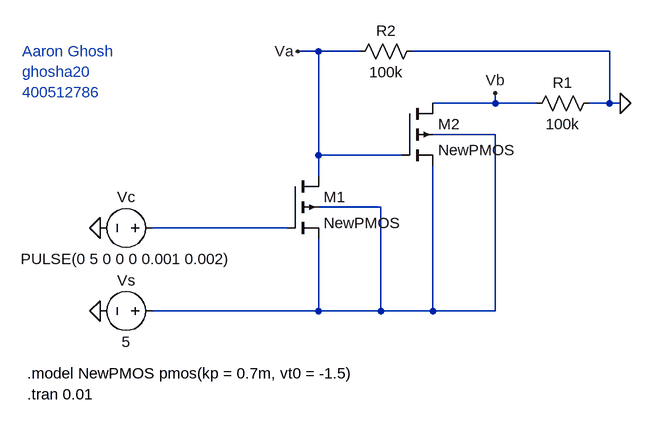
[diagram p0: schematic Project 2 Switch 2.asc]
Project 2 Switch 2.asc, the LTspice schematic file:
Version 4.1
SHEET 1 880 680
WIRE 240 64 208 64
WIRE 304 64 240 64
WIRE 688 64 384 64
WIRE 512 144 512 128
WIRE 512 144 416 144
WIRE 576 144 512 144
WIRE 688 144 688 64
WIRE 688 144 656 144
WIRE 704 144 688 144
WIRE 512 192 416 192
WIRE 240 224 240 64
WIRE 368 224 240 224
WIRE 240 256 240 224
WIRE 336 304 240 304
WIRE 192 336 -16 336
WIRE 240 464 240 352
WIRE 240 464 -16 464
WIRE 336 464 336 304
WIRE 336 464 240 464
WIRE 416 464 416 240
WIRE 416 464 336 464
WIRE 512 464 512 192
WIRE 512 464 416 464
FLAG -96 336 0
FLAG -96 464 0
FLAG 704 144 0
FLAG 208 64 Va
FLAG 512 128 Vb
SYMBOL voltage 0 336 R90
WINDOW 0 -32 56 VBottom 2
WINDOW 3 32 56 VTop 2
WINDOW 123 0 0 Left 0
WINDOW 39 0 0 Left 0
SYMATTR InstName Vc
SYMATTR Value PULSE(0 5 0 0 0 0.001 0.002)
SYMBOL voltage 0 464 R90
WINDOW 0 -32 56 VBottom 2
WINDOW 3 32 56 VTop 2
SYMATTR InstName Vs
SYMATTR Value 5
SYMBOL pmos4 192 256 R0
SYMATTR InstName M1
SYMATTR Value NewPMOS
SYMBOL pmos4 368 144 R0
SYMATTR InstName M2
SYMATTR Value NewPMOS
SYMBOL res 672 128 R90
WINDOW 0 0 56 VBottom 2
WINDOW 3 32 56 VTop 2
SYMATTR InstName R1
SYMATTR Value 100k
SYMBOL res 400 48 R90
WINDOW 0 0 56 VBottom 2
WINDOW 3 32 56 VTop 2
SYMATTR InstName R2
SYMATTR Value 100k
TEXT -216 64 Left 2 ;Aaron Ghosh\nghosha20\n400512786
TEXT -208 560 Left 2 !.model NewPMOS pmos(kp = 0.7m, vt0 = -1.5)
TEXT -208 592 Left 2 !.tran 0.01

The netlist it stands for:
* Project 2 Switch 2.asc
Vc N002 0 PULSE(0 5 0 0 0 0.001 0.002)
Vs N001 0 5
M1 Va N002 N001 N001 NewPMOS
M2 Vb Va N001 N001 NewPMOS
R1 0 Vb 100k
R2 0 Va 100k
.model NMOS NMOS
.model PMOS PMOS
.lib standard.mos
* Aaron Ghosh
* ghosha20
* 400512786
.model NewPMOS pmos(kp = 0.7m, vt0 = -1.5)
.tran 0.01
.backanno
.end